# Altium schematic sheet boost_converter_pcb_design.SchDoc
size Letter; SheetNumber: 1; SheetTotal: 1
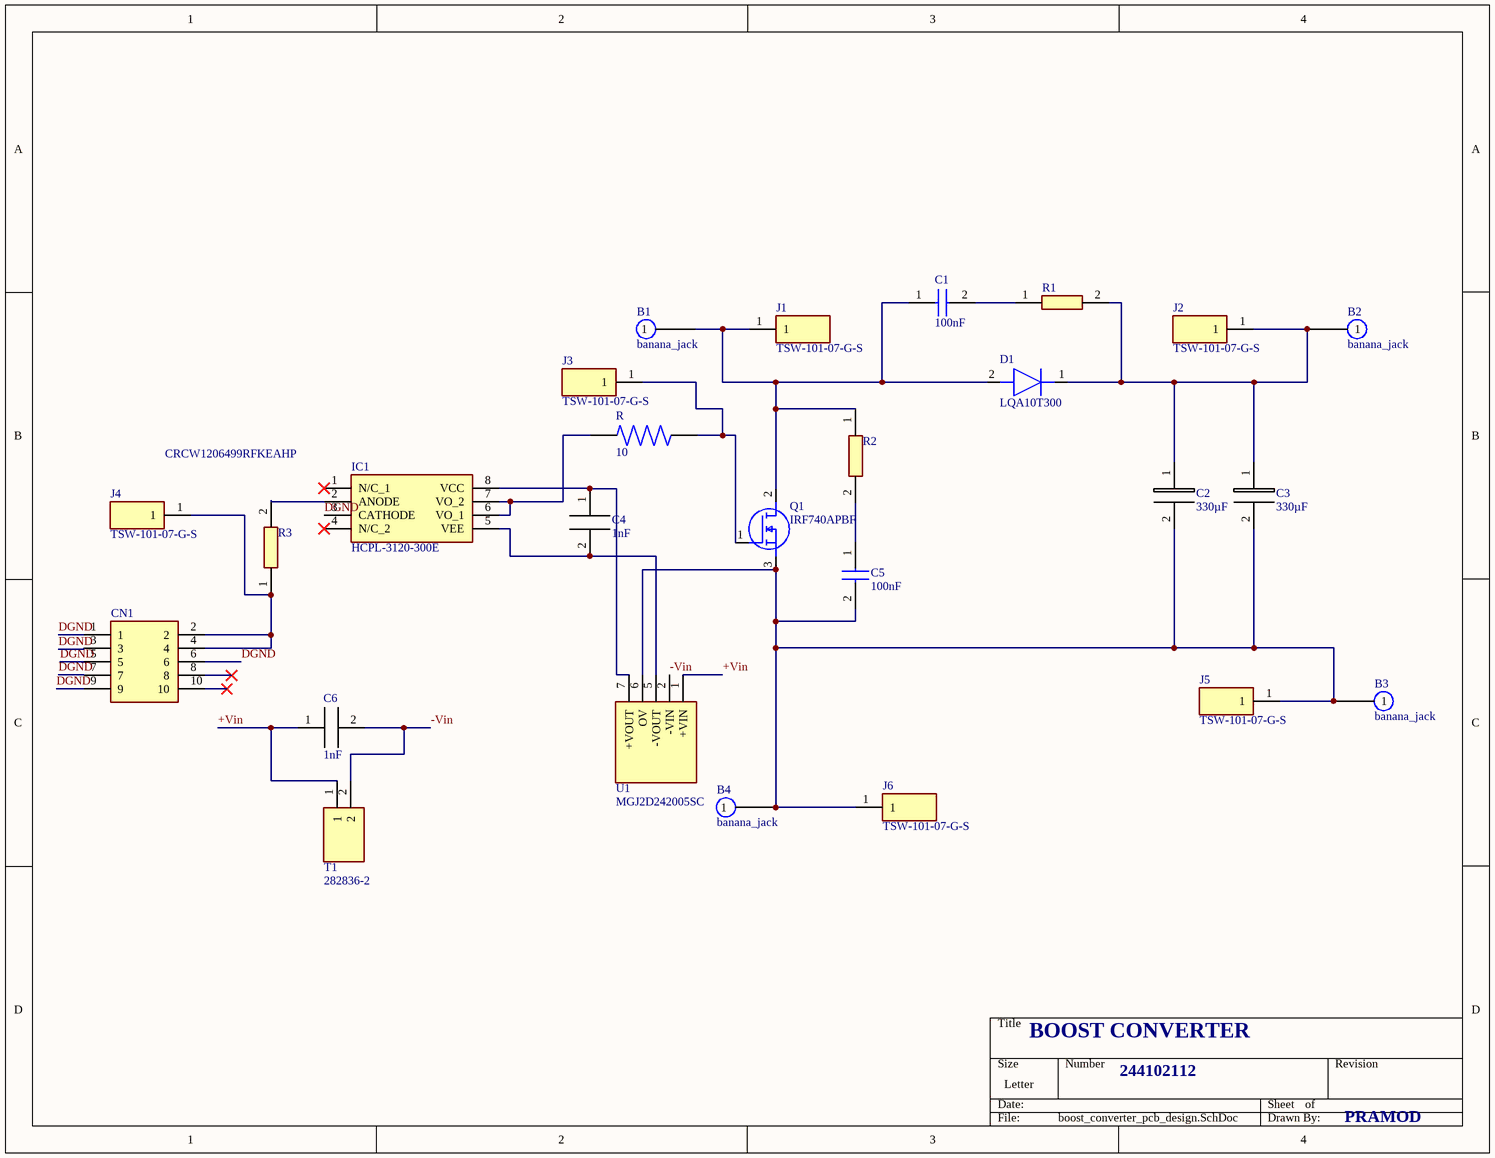
[diagram p0: boost_converter_pcb_design.SchDoc]

## Parts
B1  banana_jack  [banana_connector]
B2  banana_jack  [banana_connector]
B3  banana_jack  [banana_connector]
B4  banana_jack  [banana_connector]
C1  value 100nF  [C1206]  (hidden comment: C1206C104K5RACTU)
C2  value 330µF  [CAP_B43641A9108M057]  (hidden comment: B43541A7337M000)
C3  value 330µF  [CAP_B43641A9108M057]  (hidden comment: B43541A7337M000)
C4  value 1nF  [B32652_(18_x_5)]  (hidden comment: B32652A2102J000)
C5  value 100nF  [C1206]  (hidden comment: C1206C104K5RACTU)
C6  value 1nF  [B32652_(18_x_5)]  (hidden comment: B32652A2102J000)
CN1  30310-6002HB  [SHDR10W64P254_2X5_2030X878X930P]  (value not drawn)
D1  LQA10T300  [TO508P470X1016X2215-2P]
IC1  HCPL-3120-300E  [HCPL-3120-GULL-WING]
J1  TSW-101-07-G-S  [TSW-101-XX-YY-S]
J2  TSW-101-07-G-S  [TSW-101-XX-YY-S]
J3  TSW-101-07-G-S  [TSW-101-XX-YY-S]
J4  TSW-101-07-G-S  [TSW-101-XX-YY-S]
J5  TSW-101-07-G-S  [TSW-101-XX-YY-S]
J6  TSW-101-07-G-S  [TSW-101-XX-YY-S]
Q1  IRF740APBF  [TO254P465X1024X2050-3P]
R  value 10  [RESC2012X60N]  (hidden comment: CRCW080510R0FKEAHP)
R1  355010RFT  [RESC11050X120N]  (value not drawn)
R2  355010RFT  [RESC11050X120N]  (value not drawn)
R3  CRCW1206499RFKEAHP  [RESC3116X65N]
T1  282836-2  [2828362]
U1  MGJ2D242005SC  [MURATA-MGJ2]

## Nets
+Vin: C6.1 T1.1 U1.1(+VIN)
-Vin: C6.2 T1.2 U1.2(-VIN)
DGND: CN1.1 CN1.3 CN1.5 CN1.6 CN1.7 CN1.9 IC1.3(CATHODE)
NetB1_B?: B1.B?(1) C1.1 D1.2(A) J1.1 Q1.2(D) R2.1
NetB2_B?: B2.B?(1) C2.1 C3.1 D1.1(K) J2.1 R1.2
NetB3_B?: B3.B?(1) B4.B?(1) C2.2 C3.2 C5.2 J5.1 J6.1 Q1.3(S) U1.6(OV)
NetC1_2: C1.2 R1.1
NetC4_1: C4.1 IC1.8(VCC) U1.7(+VOUT)
NetC4_2: C4.2 IC1.5(VEE) U1.5(-VOUT)
NetC5_1: C5.1 R2.2
NetCN1_2: CN1.2 CN1.4 J4.1 R3.1
NetIC1_2: IC1.2(ANODE) R3.2
NetIC1_6: IC1.6(VO_1) IC1.7(VO_2) R.1
NetJ3_1: J3.1 Q1.1(G) R.2

Not connected (* = marked no-connect by the designer): CN1 8* 10*; IC1 1(N/C_1)* 4(N/C_2)*

## Notes on the sheet
- BOOST CONVERTER
- 244102112
- PRAMOD

## Library data of the parts
B1-B4 = CMP-037-000000-1: Source: Schlib1.SchLib; Pin Count: 1; Design Item ID: banana_jack; Component Type: Standard
C1 C5 = CMP-001-00088-1: Multilayer Ceramic / Capacitors MLCC - / SMD/SMT 50V / 0.1uF X7R 1206 / 10%; Manufacturer_Name: KEMET; Arrow Price/Stock: https://www.arrow.com/en/products/c1206c104k5ractu/kemet-corporation?region=nac; Mouser Part Number: 80-C1206C104K5R; Pins: 2; Source: Schlib1.SchLib; Arrow Part Number: C1206C104K5RACTU; Component Type: Standard; Datasheet Link: https://content.kemet.com/datasheets/KEM_C1002_X7R_SMD.pdf; Manufacturer_Part_Number: C1206C104K5RACTU; Mouser Price/Stock: https://www.mouser.co.uk/ProductDetail/KEMET/C1206C104K5RACTU?qs=VbFpUC1cecnmBMAUeCQCPw%3D%3D; Design Item ID: C1206C104K5RACTU
C2 C3 = CMP-001-00085-1: Electrolytic Capacitor, 330 µF, 550 V, ± 20%, Snap-In, 5000 hours @ 85°C; Source: Schlib1.SchLib; Design Item ID: B43541A7337M000; Component Type: Standard; Pins: 2
C4 C6 = CMP-001-00084-1: General Purpose Film Capacitor, / Metallized PP, Radial Box - 2 Pin, / 1000 pF, ± 5%, 700 V, 2 kV; Manufacturer_Name: TDK; Manufacturer_Part_Number: B32652A2102J000; Pins: 2; Component Type: Standard; Height: 10.5mm; Datasheet Link: https://product.tdk.com/system/files/dam/doc/product/capacitor/film/mkp_mfp/data_sheet/20/20/db/fc_2009/mkp_b32651_658.pdf; Design Item ID: B32652A2102J000; Source: Schlib1.SchLib
CN1 = CMP-001-00083-1: Connector; Manufacturer_Name: 3M; Pins: 10; Source: Schlib1.SchLib; Mouser Price/Stock: https://www.mouser.co.uk/ProductDetail/3M-Electronic-Solutions-Division/30310-6002HB?qs=Z%252B4xWyzEAtfC1LW5U6u5VQ%3D%3D; Mouser Part Number: 517-30310-6002; Height: 9.3mm; Datasheet Link: http://multimedia.3m.com/mws/media/22504O/3mtm-100-in-loprof-hdr-100x-100strt-ra-4-wall-ts0818.pdf; Manufacturer_Part_Number: 30310-6002HB; Design Item ID: 30310-6002HB; Arrow Price/Stock: https://www.arrow.com/en/products/30310-6002hb/3m?region=europe; Arrow Part Number: 30310-6002HB; Component Type: Standard
D1 = CMP-004-00031-1: Diode; Manufacturer_Name: Power Integrations; Design Item ID: LQA10T300; Pins: 2; Mouser Part Number: 903-LQA10T300; Mouser Price/Stock: https://www.mouser.co.uk/ProductDetail/Power-Integrations/LQA10T300?qs=GCmimEVns2r8uWm1K%2FNjDQ%3D%3D; Source: Schlib1.SchLib; Manufacturer_Part_Number: LQA10T300; Component Type: Standard; Height: 4.7mm; Datasheet Link: https://www.power.com/sites/default/files/documents/lqa10t300.pdf
IC1 = CMP-031-00015-1: Integrated Circuit; Manufacturer_Name: Avago Technologies; Mouser Price/Stock: https://www.mouser.co.uk/ProductDetail/Broadcom-Avago/HCPL-3120-300E?qs=s%252BgfxR24RQ6TPIBx%252BV5Caw%3D%3D; Mouser Part Number: 630-HCPL-3120-300E; Datasheet Link: https://datasheet.datasheetarchive.com/originals/distributors/Datasheets-DGA20/76472.pdf; Source: Schlib1.SchLib; Design Item ID: HCPL-3120-300E; Pins: 8; Component Type: Standard; Manufacturer_Part_Number: HCPL-3120-300E
J1-J6 = CMP-002-00074-1: Connector; Manufacturer_Name: SAMTEC; Arrow Part Number: TSW-101-07-G-S; Component Type: Standard; Mouser Price/Stock: https://www.mouser.co.uk/ProductDetail/Samtec/TSW-101-07-G-S?qs=hzq9O0YpnZscfPe5oPvABA%3D%3D; Arrow Price/Stock: https://www.arrow.com/en/products/tsw-101-07-g-s/samtec?region=europe; Source: Schlib1.SchLib; Design Item ID: TSW-101-07-G-S; Datasheet Link: http://suddendocs.samtec.com/prints/tsw-xxx-xx-xxx-x-xx-xxx-mkt.pdf; Mouser Part Number: 200-TSW10107GS; Pins: 1; Manufacturer_Part_Number: TSW-101-07-G-S
Q1 = CMP-037-000003-1: MOSFET (N-Channel); Manufacturer_Name: Vishay; Component Type: Standard; Manufacturer_Part_Number: IRF740APBF; Pin Count: 3; Source: Schlib1.SchLib; Arrow Price/Stock: https://www.arrow.com/en/products/irf740apbf/vishay?region=europe; Arrow Part Number: IRF740APBF; Datasheet Link: https://www.vishay.com/docs/91051/91051.pdf; Design Item ID: IRF740APBF; Mouser Price/Stock: https://www.mouser.co.uk/ProductDetail/Vishay-Semiconductors/IRF740APBF?qs=cvaI6ThkwxvN0fUna9PDCg%3D%3D; Height: 4.65mm; Mouser Part Number: 844-IRF740APBF
R = CMP-009-00179-1: 10 Ohms Â±1% 0.5W, 1/2W Chip Resistor 0805 (2012 Metric) Automotive AEC-Q200, Pulse Withstanding Thick Film; MF: Vishay; Availability: Unavailable; Pins: 2; DigiKey-Purchase-URL: https://snapeda.com/shop?store=DigiKey&id=984116; Component Type: Standard; Design Item ID: CRCW080510R0FKEAHP; MP: CRCW080510R0FKEAHP; SnapEDA_Link: https://www.snapeda.com/parts/CRCW080510R0FKEAHP/Vishay%20Dale/view-part/984116/?ref=snap; Price: None; Case/Package: 2012 Bourns; Source: Schlib1.SchLib
R1 R2 = CMP-009-00177-1: Resistor; Manufacturer_Name: TE Connectivity; Mouser Part Number: 279-355010RFT; Height: 1.2mm; Mouser Price/Stock: https://www.mouser.co.uk/ProductDetail/TE-Connectivity-Holsworthy/355010RFT?qs=gZXFycFWdAMXqTpjOt4N5g%3D%3D; Design Item ID: 355010RFT; Pins: 2; Source: Schlib1.SchLib; Manufacturer_Part_Number: 355010RFT; Datasheet Link: https://componentsearchengine.com/Datasheets/2/355010RFT.pdf; Component Type: Standard
R3 = CRCW1206499RFKEAHP: Resistor; Manufacturer_Name: Vishay; Height: 0.65mm; Manufacturer_Part_Number: CRCW1206499RFKEAHP; Mouser Part Number: 71-CRCW1206499RFKEAH; Mouser Price/Stock: https://www.mouser.com/Search/Refine.aspx?Keyword=71-CRCW1206499RFKEAH; Arrow Part Number: CRCW1206499RFKEAHP; Arrow Price/Stock: https://www.arrow.com/en/products/crcw1206499rfkeahp/vishay
T1 = CMP-012-00000-1: Connector; Manufacturer_Name: TE Connectivity; Height: 10mm; Manufacturer_Part_Number: 282836-2; Arrow Price/Stock: https://www.arrow.com/en/products/282836-2/te-connectivity?region=europe; Design Item ID: 282836-2; Source: Schlib1.SchLib; Mouser Part Number: 571-2828362; Datasheet Link: https://www.te.com/commerce/DocumentDelivery/DDEController?Action=showdoc&DocId=Customer+Drawing%7F282836%7FJ%7Fpdf%7FEnglish%7FENG_CD_282836_J.pdf%7F282836-2; Pins: 2; Component Type: Standard; Mouser Price/Stock: https://www.mouser.co.uk/ProductDetail/TE-Connectivity/282836-2?qs=A%252Bip%252BNCYi6Ohx9vaQ1l4dg%3D%3D; Arrow Part Number: 282836-2
U1 = CMP-037-000006-1: Undefined or Miscellaneous; Manufacturer_Name: Murata Electronics; Mouser Part Number: 580-MGJ2D242005SC; Mouser Price/Stock: https://www.mouser.co.uk/ProductDetail/Murata-Power-Solutions/MGJ2D242005SC?qs=xLDY6iXSiQZFsrjCzeaXXw%3D%3D; Pin Count: 5; Source: Schlib1.SchLib; Datasheet Link: http://power.murata.com/data/power/ncl/kdc_mgj2.pdf; Arrow Part Number: MGJ2D242005SC; Arrow Price/Stock: https://www.arrow.com/en/products/mgj2d242005sc/murata-power-solutions?region=nac; Design Item ID: MGJ2D242005SC; Component Type: Standard; Manufacturer_Part_Number: MGJ2D242005SC